# EAGLE design LED Wall Ver 3 (EAGLE 6.3)
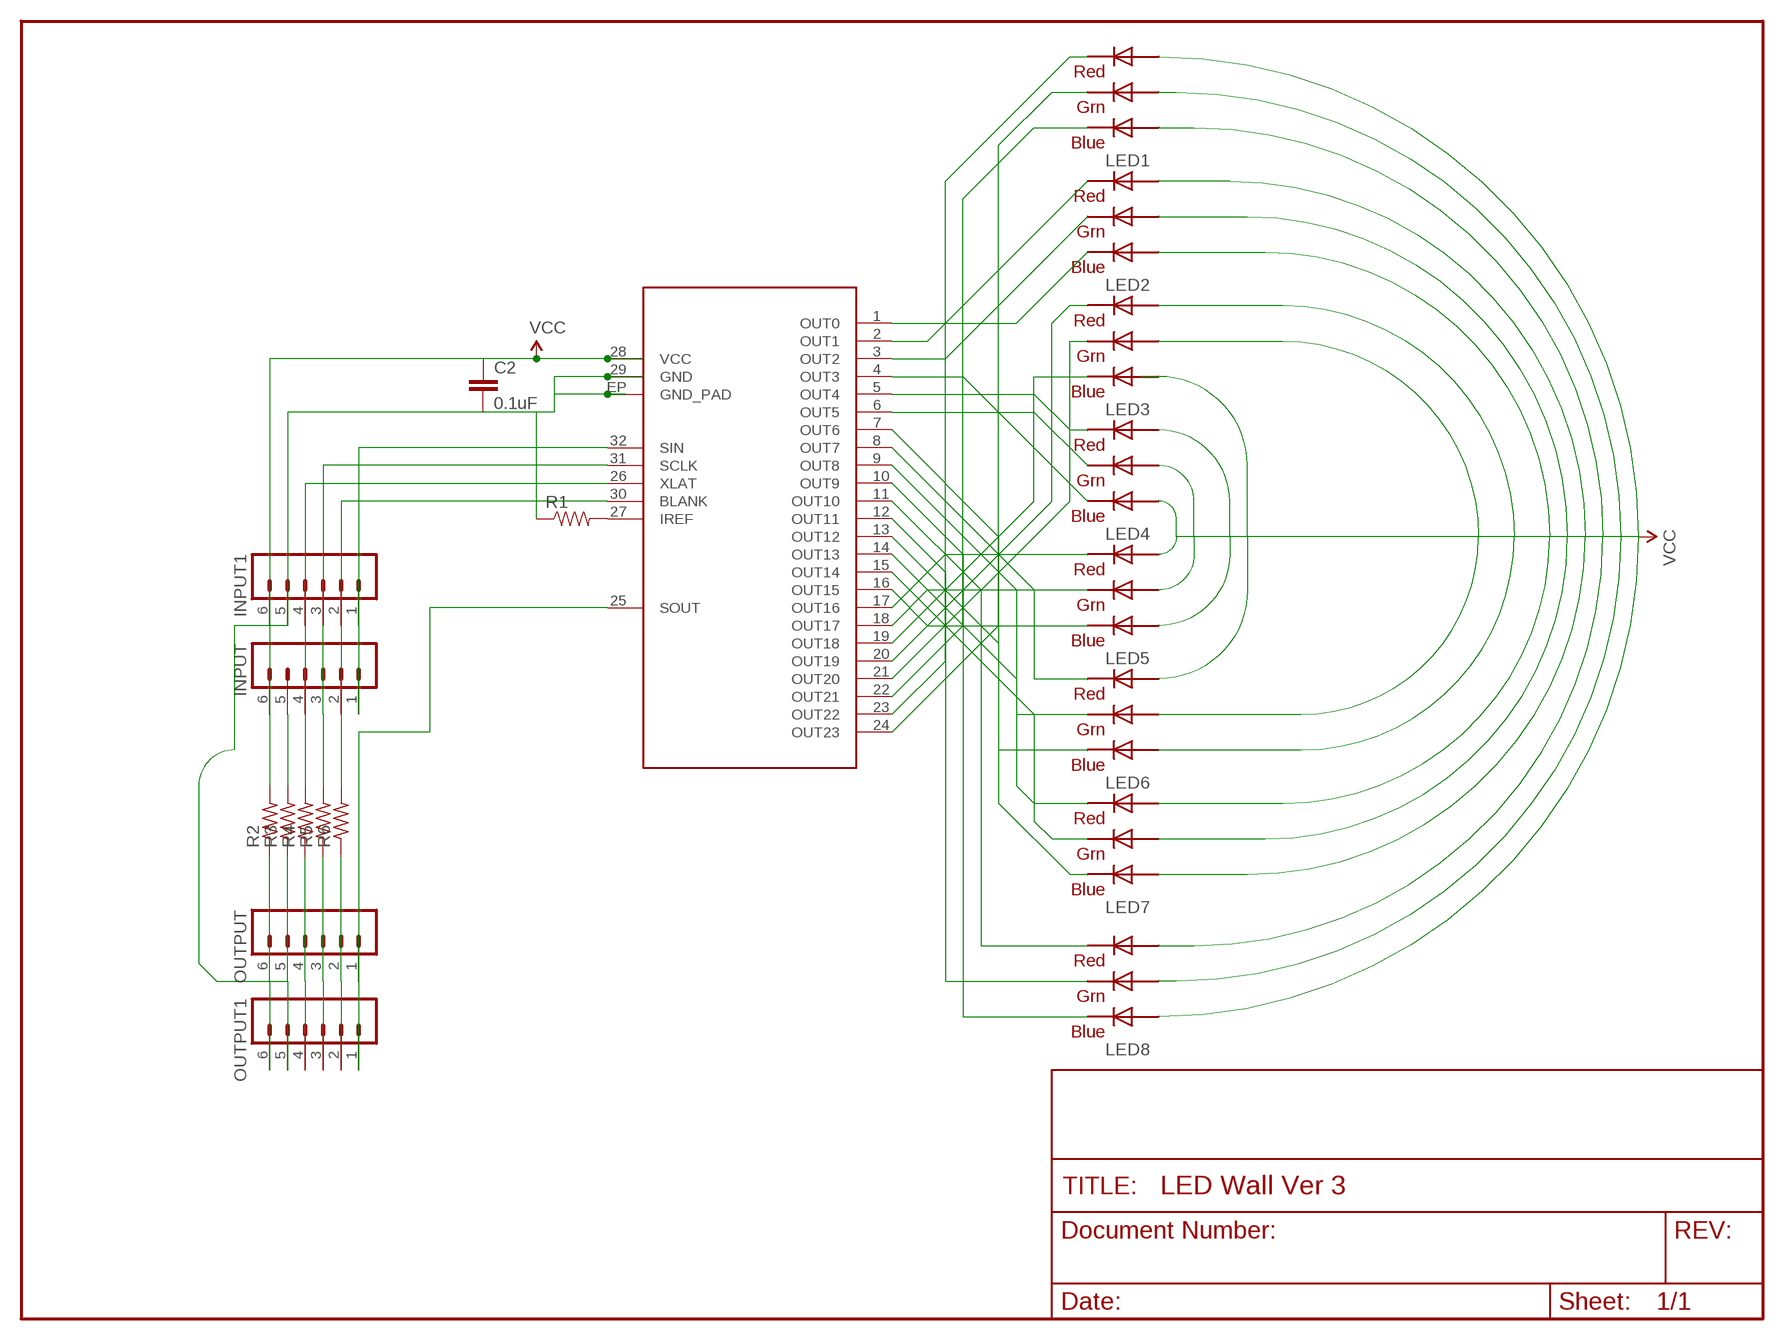
[diagram p0: schematic, sheet 1]

## Parts
C2  0.1uF  CAP0402-CAP  [0402-CAP]
INPUT  M06SMD-FEMALE-V2  [1X06-SMD-FEMALE-V2]
INPUT1  M06SMD-FEMALE-V2  [1X06-SMD-FEMALE-V2]
LED1  RGBLED5050  [RGBLED5050]
LED2  RGBLED5050  [RGBLED5050]
LED3  RGBLED5050  [RGBLED5050]
LED4  RGBLED5050  [RGBLED5050]
LED5  RGBLED5050  [RGBLED5050]
LED6  RGBLED5050  [RGBLED5050]
LED7  RGBLED5050  [RGBLED5050]
LED8  RGBLED5050  [RGBLED5050]
OUTPUT  M06SMD  [1X06-SMD]
OUTPUT1  M06SMD  [1X06-SMD]
R1  RESISTOR0603-RES  [0603-RES]
R2  R-US_R1206W  [R1206W]
R3  R-US_R1206W  [R1206W]
R4  R-US_R1206W  [R1206W]
R5  R-US_R1206W  [R1206W]
R6  R-US_R1206W  [R1206W]
U$2  TLC5947  [QFN-32]

## Nets
BLANK: INPUT1.2 INPUT.2 R6.2 U$2.30(BLANK)
BLANK_2: OUTPUT1.2 OUTPUT.2 R6.1
GND: C2.2 INPUT1.5 OUTPUT1.5 OUTPUT.5 R1.1 R3.1 U$2.29(GND) U$2.EP(GND_PAD)
N$4: LED2.4(BLUE_C) U$2.1(OUT0)
N$5: LED2.5(RED_C) U$2.2(OUT1)
N$7: LED2.6(GREEN_C) U$2.3(OUT2)
N$8: LED8.4(BLUE_C) U$2.10(OUT9)
N$10: LED4.5(RED_C) U$2.5(OUT4)
N$17: LED4.4(BLUE_C) U$2.4(OUT3)
N$18: LED4.6(GREEN_C) U$2.6(OUT5)
N$19: LED6.4(BLUE_C) U$2.7(OUT6)
N$20: LED6.5(RED_C) U$2.8(OUT7)
N$21: LED6.6(GREEN_C) U$2.9(OUT8)
N$22: LED8.5(RED_C) U$2.11(OUT10)
N$23: LED8.6(GREEN_C) U$2.12(OUT11)
N$24: LED7.4(BLUE_C) U$2.13(OUT12)
N$25: LED7.5(RED_C) U$2.14(OUT13)
N$26: LED7.6(GREEN_C) U$2.15(OUT14)
N$27: LED5.4(BLUE_C) U$2.16(OUT15)
N$28: LED5.5(RED_C) U$2.17(OUT16)
N$29: LED5.6(GREEN_C) U$2.18(OUT17)
N$30: LED3.4(BLUE_C) U$2.19(OUT18)
N$31: R1.2 U$2.27(IREF)
N$32: LED3.5(RED_C) U$2.20(OUT19)
N$33: LED3.6(GREEN_C) U$2.21(OUT20)
N$34: LED1.4(BLUE_C) U$2.22(OUT21)
N$35: LED1.5(RED_C) U$2.23(OUT22)
N$36: LED1.6(GREEN_C) U$2.24(OUT23)
N$37: INPUT.5 R3.2
SCLK: INPUT1.3 INPUT.3 R5.2 U$2.31(SCLK)
SCLK_2: OUTPUT1.3 OUTPUT.3 R5.1
SIN: INPUT1.1 INPUT.1 U$2.32(SIN)
SOUT: OUTPUT1.1 OUTPUT.1 U$2.25(SOUT)
VCC: C2.1 INPUT1.6 INPUT.6 LED1.1(GREEN_A) LED1.2(RED_A) LED1.3(BLUE_A) LED2.1(GREEN_A) LED2.2(RED_A) LED2.3(BLUE_A) LED3.1(GREEN_A) LED3.2(RED_A) LED3.3(BLUE_A) LED4.1(GREEN_A) LED4.2(RED_A) LED4.3(BLUE_A) LED5.1(GREEN_A) LED5.2(RED_A) LED5.3(BLUE_A) LED6.1(GREEN_A) LED6.2(RED_A) LED6.3(BLUE_A) LED7.1(GREEN_A) LED7.2(RED_A) LED7.3(BLUE_A) LED8.1(GREEN_A) LED8.2(RED_A) LED8.3(BLUE_A) R2.2 U$2.28(VCC)
VCC_2: OUTPUT1.6 OUTPUT.6 R2.1
XLAT: INPUT1.4 INPUT.4 R4.2 U$2.26(XLAT)
XLAT_2: OUTPUT1.4 OUTPUT.4 R4.1

## Library data of the parts
C2 = SparkFun:CAP: Capacitor Standard 0603 ceramic capacitor, and 0.1" leaded capacitor.
INPUT INPUT1 OUTPUT OUTPUT1 = SparkFun:M06: Header 6 Standard 6-pin 0.1" header. Use with straight break away headers (SKU : PRT-00116), right angle break away headers (PRT-00553), swiss pins (PRT-00743), machine pins (PRT-00117), and female headers (PRT-00115). Molex polarized connector foot print use with SKU : PRT-08094 with associated crimp pins and housings. NOTES ON THE VARIANTS LOCK and LOCK_LONGPADS... This footprint was designed to help hold the alignment of a through-hole component (i.e. 6-pin header) while soldering it into place. You may notice that each hole has been shifted either up or down by 0.005 of an inch from it's more standard position (which is a perfectly straight line). This slight alteration caused the pins (the squares in the middle) to touch the edges of the holes. Because they are alternating, it causes a "brace" to hold the component in place. 0.005 has proven to be the perfect amount of "off-center" position when using our standard breakaway headers. Although looks a little odd when you look at the bare footprint, once you have a header in there, the alteration is very hard to notice. Also, if you push a header all the way into place, it is covered up entirely on the bottom side. This idea of altering the position of holes to aid alignment will be further integrated into the Sparkfun Library for other footprints. It can help hold any component with 3 or more connection pins.
LED1-LED8 = adafruit:RGBLED: For 5050 RGB LEDs, the order of the LEDs may vary from one manufacturer to another!
R1 = SparkFun-Resistors:RESISTOR: Resistor Basic schematic elements and footprints for 0603, 1206, and PTH resistors.
R2-R6 = adafruit:R-US_: RESISTOR, American symbol
U$2 = Shannon:TLC5947

## Board
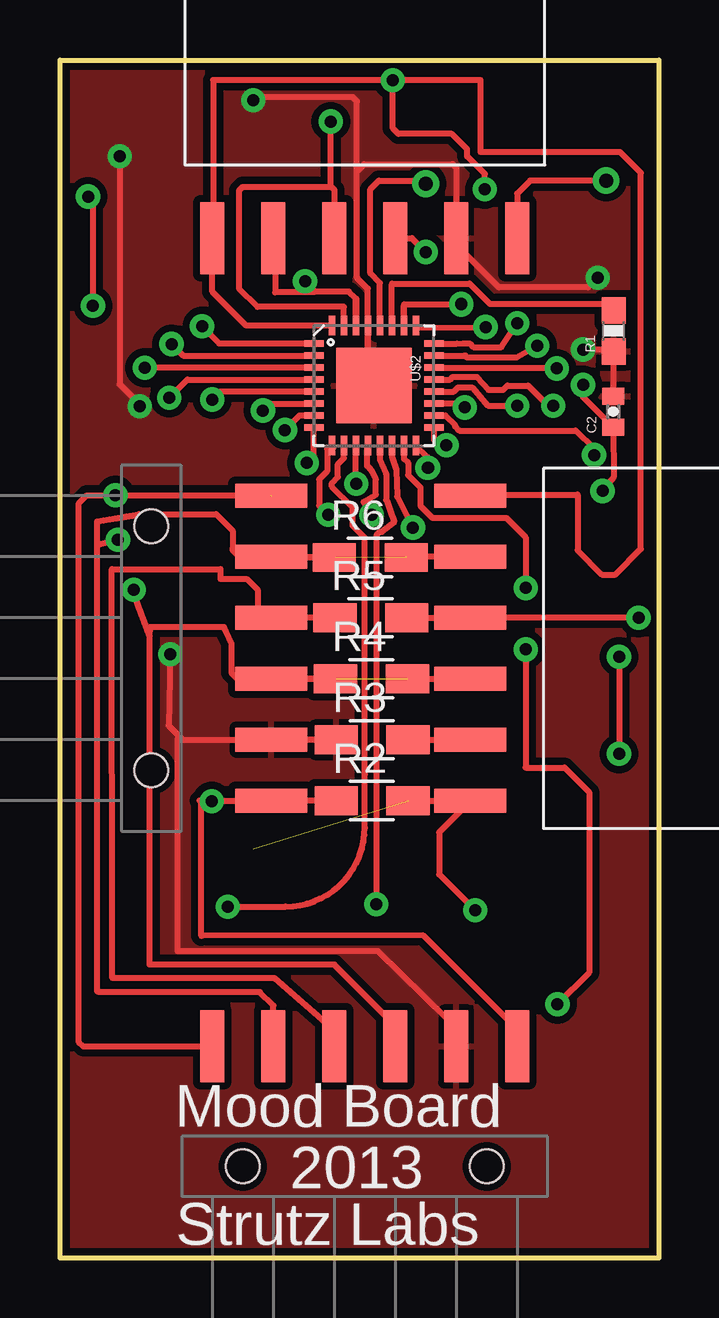
[diagram p1: board, top side]
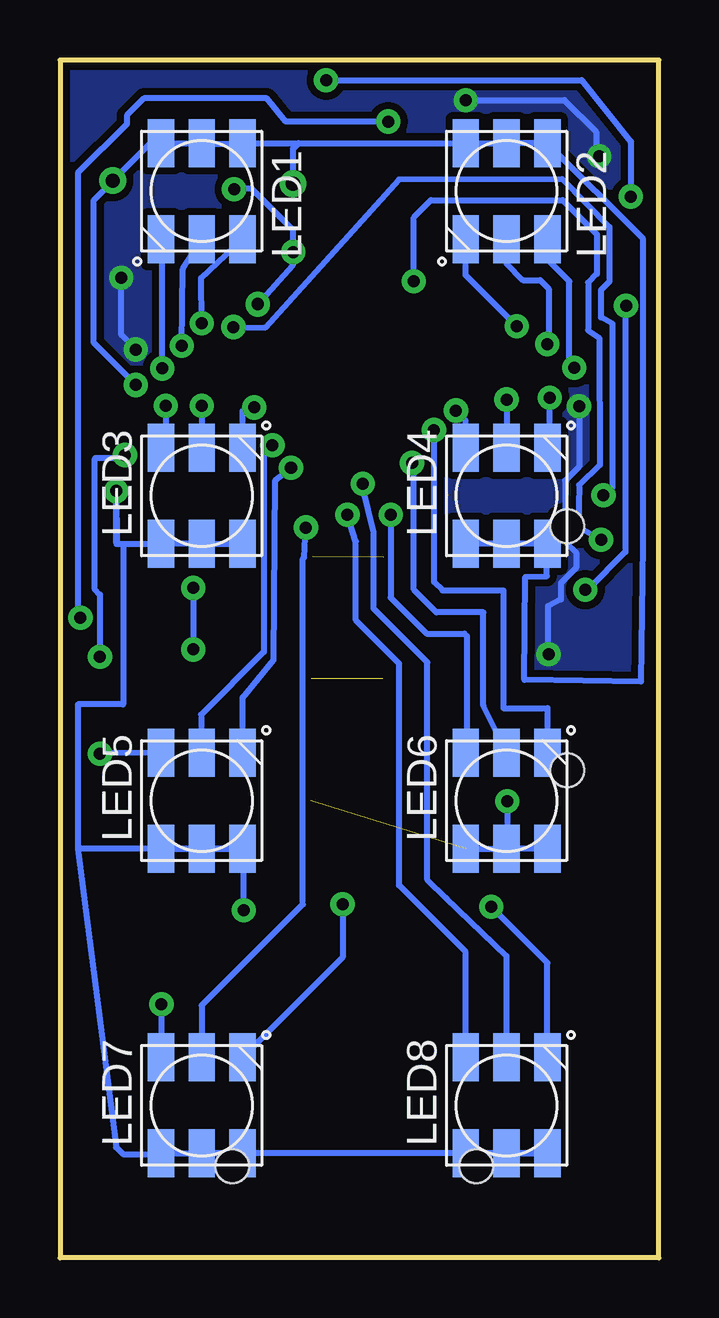
[diagram p2: board, bottom side, seen from below]

Size 24.96 x 49.91 mm. Coordinates in mm from the lower left corner, seen from the top.
Outline: 0,0 24.96,0 24.96,49.91 0,49.91 0,0
Copper layers (1*16): Top 0.035mm / dielectric 1.5mm / Bottom 0.035mm
Design rules "SparkFun": minimum track width 8mil, minimum drill 20mil, track to track 8mil, track to pad 8mil, pad to pad 8mil, via to via 8mil, smd to smd 8mil, copper to edge 8mil, drill to drill 8mil, minimum pad ring 12mil, minimum via ring 10mil, stop-mask expansion 4mil, vias tented up to drill 20mil, thermal gap 10mil

### Footprints (pad centres in the part's own frame; a part is rotated, then mirrored left to right if it is on the bottom)
0402-CAP = smd 0.7 x 0.9: 1 -0.65,0; 2 0.65,0
1X06-SMD-FEMALE-V2 = smd 1 x 3: 1 6.35,4.5; 2 3.81,4.5; 3 1.27,4.5; 4 -1.27,4.5; 5 -3.81,4.5; 6 -6.35,4.5
RGBLED5050 = smd 2 x 1.1: 1 -2,1.7; 2 -2,0; 3 -2,-1.7; 4 2,-1.7; 5 2,0; 6 2,1.7
1X06-SMD = smd 1 x 3: 1 -6.35,5; 2 -3.81,5; 3 -1.27,5; 4 1.27,5; 5 3.81,5; 6 6.35,5 | hole 1.4: -5.08,0; 5.08,0
0603-RES = smd 1.1 x 1: 1 -0.85,0; 2 0.85,0
R1206W = smd 1.8 x 1.2: 1 -1.499,0; 2 1.499,0
QFN-32 = smd 0.285 x 0.8: 1 -1.75,-2.5; 2 -1.25,-2.5; 3 -0.75,-2.5; 4 -0.25,-2.5; 5 0.25,-2.5; 6 0.75,-2.5; 7 1.25,-2.5; 8 1.75,-2.5; 17 1.75,2.5; 18 1.25,2.5; 19 0.75,2.5; 20 0.25,2.5; 21 -0.25,2.5; 22 -0.75,2.5; 23 -1.25,2.5; 24 -1.75,2.5 | smd 0.8 x 0.285: 9 2.5,-1.75; 10 2.5,-1.25; 11 2.5,-0.75; 12 2.5,-0.25; 13 2.5,0.25; 14 2.5,0.75; 15 2.5,1.25; 16 2.5,1.75; 25 -2.5,1.75; 26 -2.5,1.25; 27 -2.5,0.75; 28 -2.5,0.25; 29 -2.5,-0.25; 30 -2.5,-0.75; 31 -2.5,-1.25; 32 -2.5,-1.75 | smd 3.15 x 3.15: EP 0,0

### Placement (x,y rotation side)
C2  23.05,35.26 90 top
INPUT  21.59,25.4 90 top
INPUT1  12.7,46.99 180 top
LED1  19.05,44.45 270 bottom
LED2  6.35,44.45 270 bottom
LED3  19.05,31.75 90 bottom
LED4  6.35,31.75 90 bottom
LED5  19.05,19.05 90 bottom
LED6  6.35,19.05 90 bottom
LED7  19.05,6.35 90 bottom
LED8  6.35,6.35 90 bottom
OUTPUT  3.81,25.4 270 top
OUTPUT1  12.7,3.81 0 top
R1  23.06,38.62 90 top
R2  13,19.05 0 top
R3  13,21.59 0 top
R4  12.98,24.13 0 top
R5  12.95,26.67 0 top
R6  12.93,29.18 0 top
U$2  13.08,36.35 270 top

### Tracks (layer width: path | path; a pad name or v marks a point on that pad's centre or on a via)
BLANK  (via drill 0.5 pad 0.25)  (1 unrouted)
  Top 0.254: INPUT.2 14.43,29.21 R6.2 | INPUT1.2 8.97,42.41 8.97,40.23 8.99,40.26 10.64,40.26 | 12.32,39.98 12.34,39.95 12.34,38.86 U$2.30 12.33,39.94 12.32,39.95 12.32,39.98 | 12.32,39.98 12.04,40.26 10.64,40.26 | 10.64,40.26 v10.21,40.69 | v2.41,29.92 1.55,29.69 1.55,30.68 3.43,30.99 6.5,30.99 7.19,30.3 7.19,29.57 7.47,29.29 9.93,29.29 10.03,29.18 11.48,29.18
  Bottom 0.254: v10.21,40.69 10.21,43.36 9.5,44.07 4.01,44.07 2.59,42.65 2.59,41 2.95,40.64 2.95,38.66 2.49,38.33 2.46,33.05 3.33,32.21 3.35,30.45 v2.41,29.92
BLANK_2
  Top 0.254: R6.1 8.81,29.18 OUTPUT.2 7.47,29.21 7.19,29.49 7.19,30.3 6.5,30.99 3.3,30.99 2.9,30.91 1.57,30.68 1.55,30.66 1.55,11.12 1.6,11.07 8.33,11.07 8.89,10.52 OUTPUT1.2
GND  (via drill 0.5 pad 0.25)
  Top 0.254: 12.83,40.39 12.83,40.38 U$2.29 12.83,36.6 U$2.EP 12.83,36.35 12.83,40.39 | 12.37,45.26 12.37,40.84 12.83,40.39 | 12.37,45.26 12.68,45.57 16.36,45.57 16.51,45.41 INPUT1.5 16.51,42.22 18.29,40.44 22,40.44 v22.4,40.84 | C2.2 23.06,36.65 R1.1 22.99,37.85 v21.79,37.85 | R3.1 OUTPUT.5 5.11,21.59 | OUTPUT1.5 16.51,9.57 16.13,9.96 13.26,12.78 4.9,12.78 4.9,21.61 4.93,21.59 5.11,21.59 | 12.37,45.26 12.37,48.18 12.19,48.36 8.18,48.36 v8.05,48.23 | v2.49,45.9 2.49,36.4 3.33,35.56 v3.33,35.48 | v4.6,25.15 4.52,22.17 5.11,21.59
  Bottom 0.254: v21.79,37.85 22.4,38.46 v22.4,40.84 | v8.05,48.23 3.94,48.23 2.62,46.91 2.62,46.02 v2.49,45.9 | v3.33,35.48 3.33,32.97 3.91,32.38 3.91,31.19 3.81,31.09 3.81,29.74 3.45,29.39 3.45,28.75 4.09,28.12 4.09,27.43 4.62,27.15 4.62,25.3 v4.6,25.15
  pour Bottom (isolate 0.305): 0,49.91 0,0 24.96,0 24.96,49.91
  pour Top (isolate 0.305): 0,49.91 0,0 24.96,0 24.96,49.91
N$4  (via drill 0.5 pad 0.25)
  Top 0.254: U$2.1 6.63,38.1 v5.92,38.81
  Bottom 0.254: v5.92,38.81 8.05,40.94 LED2.4
N$5  (via drill 0.5 pad 0.25)
  Top 0.254: v4.65,38.08 5.12,37.6 U$2.2
  Bottom 0.254: LED2.5 6.35,41.43 5.66,40.74 4.95,40.74 4.6,40.39 4.6,38.12 v4.65,38.08
N$6  (via drill 0.5 pad 0.25)
  other vias: 16.71,39.75
N$7  (via drill 0.5 pad 0.25)
  Top 0.254: U$2.3 3.53,37.1 v3.53,37.08
  Bottom 0.254: v3.53,37.08 3.73,37.29 3.73,40.69 4.65,41.61 LED2.6
N$8  (via drill 0.5 pad 0.25)
  Top 0.254: v6.99,14.63 9.4,14.63 arc90 12.7,17.93 12.7,30 12.19,30.5 12.19,31.27 11.33,32.13 11.33,32.28 11.58,32.54 11.58,33.07 11.83,33.32 U$2.10
  Bottom 0.254: LED8.4 4.65,12.29 v6.99,14.63
N$10  (via drill 0.5 pad 0.25)
  Top 0.254: U$2.5 6.68,36.1 v6.35,35.76
  Bottom 0.254: v6.35,35.76 LED4.5
N$12  (via drill 0.6)
  other vias: 15.24,44.75
N$13  (via drill 0.6)
  other vias: 22.76,44.88
N$16
  Top 0.254: 12.7,17.91 12.7,20.14
N$17  (via drill 0.5 pad 0.25)
  Top 0.254: v4.55,35.84 5.3,36.6 U$2.4
  Bottom 0.254: LED4.4 4.55,33.85 v4.55,35.84
N$18  (via drill 0.5 pad 0.25)
  Top 0.254: v8.46,35.31 8.75,35.6 U$2.6
  Bottom 0.254: LED4.6 8.05,34.9 v8.46,35.31
N$19  (via drill 0.5 pad 0.25)
  Top 0.254: U$2.7 9.98,35.1 v9.37,34.49
  Bottom 0.254: v9.37,34.49 9.37,28.17 9.02,27.81 6.48,27.81 6.48,22.91 4.65,22.91 LED6.4
N$20  (via drill 0.5 pad 0.25)
  Top 0.254: v10.29,33.12 10.58,33.42 U$2.8
  Bottom 0.254: LED6.5 7.32,23.01 7.32,26.9 9.27,26.9 10.21,27.84 10.21,33.05 v10.29,33.12
N$21  (via drill 0.5 pad 0.25)
  Top 0.254: U$2.9 11.4,33.77 11.19,33.77 11.12,33.71 11.12,32.77 10.79,32.44 10.79,31.34 v11.18,30.96
  Bottom 0.254: v11.18,30.96 11.18,27.51 9.68,26.01 8.1,26.01 8,25.91 8,21.1 LED6.6
N$22  (via drill 0.5 pad 0.25)
  Top 0.254: v12.34,32.26 12.33,32.35 U$2.11
  Bottom 0.254: LED8.5 6.35,12.57 8.89,15.01 8.84,14.96 9.65,15.75 9.65,24.82 11.89,27.05 11.89,30.23 12.34,32.11 v12.34,32.26
N$23  (via drill 0.5 pad 0.25)
  Top 0.254: v12.98,30.96 12.65,31.5 13.16,31.8 13.16,32.44 12.98,32.79 12.9,32.89 12.8,32.99 12.8,33.82 U$2.12
  Bottom 0.254: LED8.6 8.05,12.75 10.82,15.52 10.82,24.77 12.62,26.57 12.62,29.84 v12.98,30.96
N$24  (via drill 0.5 pad 0.25)
  Top 0.254: U$2.13 13.33,33.28 13.59,32.66 13.59,31.57 13.61,31.55 13.92,30.66 13.41,30.25 13.31,30.23 13.18,30.1 v13.18,14.73
  Bottom 0.254: v13.18,14.73 13.18,12.52 LED7.4
N$25  (via drill 0.5 pad 0.25)
  Top 0.254: U$2.14 13.83,33.39 14.02,32.84 14.05,31.73 v14.71,30.43
  Bottom 0.254: LED7.5 19.05,10.52 14.83,14.73 14.83,29.13 14.78,29.18 v14.71,30.43
N$26  (via drill 0.5 pad 0.25)
  Top 0.254: U$2.15 14.33,33.29 14.5,33.12 14.5,32.61 15.01,32.11 15.01,31.34 15.52,30.84 18.59,30.84 19.41,30.02 v19.41,27.91 | v19.41,25.35 19.41,20.42 21.03,20.42 22.05,19.41 22.05,11.89 v20.73,10.57
  Bottom 0.254: v19.41,27.91 v19.41,25.35 | v20.73,10.57 20.73,8.37 LED7.6
N$27  (via drill 0.5 pad 0.25)
  Top 0.254: v15.32,32.92 15.32,33.36 U$2.16
  Bottom 0.254: LED5.4 17.35,23.34 16.05,24.92 15.98,32.41 v15.32,32.92
N$28  (via drill 0.5 pad 0.25)
  Top 0.254: U$2.17 15.58,34.08 v16.1,33.86
  Bottom 0.254: v16.1,33.86 16.46,33.63 16.46,25.25 19.07,22.63 19.07,21.07 LED5.5
N$29  (via drill 0.5 pad 0.25)
  Top 0.254: U$2.18 16.06,35.1 16.46,34.7 16.46,34.65 16.64,34.47 21.49,34.47 22.25,33.71 v22.25,33.45 | v23.29,25.04 v23.29,21.01
  Bottom 0.254: v22.25,33.45 22.38,33.33 23.47,33.33 23.52,33.27 23.52,27.89 23.29,27.64 v23.29,25.04 | v23.29,21.01 23.29,21.06 LED5.6
N$30  (via drill 0.5 pad 0.25)
  Top 0.254: v16.87,35.43 16.9,35.6 U$2.19
  Bottom 0.254: LED3.4 17.35,35.28 17.09,35.53 v16.87,35.43
N$31
  Top 0.254: U$2.27 13.83,40.58 13.84,40.59 17.07,40.59 17.91,39.75 23.19,39.75 23.21,39.47 R1.2
N$32  (via drill 0.5 pad 0.25)
  Top 0.254: U$2.20 16.41,36.1 16.59,36.27 17.17,36.27 17.83,35.51 v19.05,35.51
  Bottom 0.254: v19.05,35.51 LED3.5
N$33  (via drill 0.5 pad 0.25)
  Top 0.254: U$2.21 16.25,36.6 16.36,36.7 17.37,36.7 17.86,36.17 18.47,36.17 18.64,36.35 19.51,36.35 20.34,35.51 v20.55,35.51
  Bottom 0.254: v20.55,35.51 20.55,33.95 LED3.6
N$34  (via drill 0.5 pad 0.25)
  Top 0.254: U$2.22 20.66,37.1 v20.7,37.06
  Bottom 0.254: v20.7,37.06 20.7,42.4 LED1.4
N$35  (via drill 0.5 pad 0.25)
  Top 0.254: U$2.23 16.86,37.6 16.87,37.59 16.89,37.59 16.97,37.52 19.02,37.52 v19.89,38
  Bottom 0.254: v19.89,38 19.84,41.2 LED1.5
N$36  (via drill 0.5 pad 0.25)
  Top 0.254: U$2.24 16.53,38.1 16.79,38.1 17.07,38.1 17.22,37.95 18.39,37.95 v19.05,38.94
  Bottom 0.254: v19.05,38.94 19.07,40.83 LED1.6
N$37
  Top 0.254: R3.2 INPUT.5
N$40  (via drill 0.5 pad 0.25)
  other vias: 15.34,32.92
SCLK  (via drill 0.5 pad 0.25)
  Top 0.254: 11.28,44.63 11.3,44.63 11.43,44.5 INPUT1.3 | U$2.31 11.83,39.62 11.84,39.62 8.23,39.62 7.47,40.39 7.47,44.48 7.62,44.63 11.28,44.63 | 11.28,44.63 v11.28,47.35 | v24.11,26.67 INPUT.3 R5.2
  Bottom 0.254: v11.28,47.35 15.54,47.35 16.33,48.31 21.46,48.31 22.17,47.6 22.17,47.24 24.21,45.21 24.21,26.77 v24.11,26.67
SCLK_2
  Top 0.254: R5.1 OUTPUT.3 | OUTPUT1.3 11.43,9.47 8.94,11.66 2.18,11.66 2.16,28.7 6.68,28.7 6.68,28.3 7.77,28.3 8.23,27.84 8.23,26.7 8.26,26.67 OUTPUT.3 | 8.79,26.7 OUTPUT.3
SIN
  Top 0.254: U$2.32 7.76,38.85 6.35,40.26 INPUT1.1 6.38,42.52 6.38,49.07 17.53,49.07 17.53,46.08 23.34,46.08 24.21,45.21 24.21,29.54 23.14,28.47 22.58,28.47 21.57,29.49 21.57,31.8 17.14,31.8 INPUT.1
SOUT  (via drill 0.5 pad 0.25)  (1 unrouted)
  Top 0.254: U$2.25 14.92,38.76 v17.73,38.79 | 8.79,31.77 v2.31,31.77 1.12,31.77 0.79,31.45 0.79,8.99 0.97,8.81 OUTPUT1.1
  Bottom 0.254: v17.73,38.79 16.41,38.76 10.82,44.93 4.04,44.96 2.06,42.95 2.06,40.69 2.41,40.34 2.41,39.19 1.93,38.91 1.93,32.11 2.06,32.03 v2.31,31.77
VCC  (via drill 0.5 pad 0.25, 0.6)  (1 unrouted)
  Top 0.254: U$2.28 13.33,40.62 12.93,41.02 12.93,44.53 13.28,44.88 15.11,44.88 v15.24,44.76 | v22.76,44.88 19.58,44.88 19.05,44.35 INPUT1.6 | v21.79,36.37 21.79,35.86 C2.1 23.06,32.53 v22.61,31.95 | 6.35,19.05 v6.33,19.02 | R2.2 INPUT.6 17.09,19.02 15.8,17.73 15.8,15.98 v17.3,14.48
  Bottom 0.254: LED8.1 LED8.2 LED8.3 LED7.2 | LED7.1 20.24,4.35 | 20.24,4.35 LED7.2 | LED7.2 LED7.3 | LED6.1 LED6.2 | LED6.3 LED6.2 | LED5.3 LED5.1 | LED5.1 LED5.2 LED5.3 | LED1.3 LED1.2 19,46.45 19,46.43 | 19,46.43 17.35,46.43 LED1.1 15.01,46.45 | 15.01,46.45 LED2.3 LED2.2 | LED2.2 6.27,46.45 6.27,46.46 | 6.27,46.46 LED2.1 0.66,42.46 0.66,29.74 0.74,24.01 5.61,24.09 5.56,28.37 4.67,28.4 LED4.3 LED4.2 LED4.1 | v15.24,44.76 15.24,46.22 15.01,46.45 | 19,46.43 21.21,46.43 v22.76,44.88 22.76,44.86 23.55,44.07 23.55,38.12 v21.79,36.37 | v6.33,19.02 6.33,17.07 LED6.2 | 24.21,17.17 24.21,23.06 22.33,23.06 22.33,29.74 22.61,29.77 v22.61,31.95 22.6,29.75 LED3.1 LED3.2 LED3.3 | 24.21,17.17 24.21,17.04 24.21,17.05 22.61,4.6 22.33,4.32 20.28,4.32 20.24,4.35 | 6.27,46.46 LED2.2 | LED5.1 24.09,17.05 24.21,17.17 | v17.3,14.48 17.3,17 LED5.3
VCC_2
  Top 0.254: R2.1 OUTPUT.6 5.89,19.05 | 5.89,19.05 5.89,13.41 15.13,13.44 19.05,9.52 OUTPUT1.6 | 5.89,19.05 5.82,19.05
XLAT  (via drill 0.5 pad 0.25)  (1 unrouted)
  Top 0.254: INPUT1.4 14.66,42.49 v15.24,41.91 | 14.35,39.73 14.33,39.73 U$2.26 14.33,39.68 14.35,39.7 14.35,39.73 | R4.2 INPUT.4 | 14.35,39.73 v16.71,39.73 | v17.7,44.53 17.7,45.16 16.97,45.9 16.97,46.2 16.33,46.84 14.1,46.84 13.87,47.07 v13.87,49.07 | v1.17,44.22 1.37,44.02 v1.37,39.67 | v3.07,27.84 3.1,27.56 3.73,25.86 3.76,26.29 6.81,26.29 7.14,25.6 7.14,24.38 7.39,24.13 11.51,24.13
  Bottom 0.254: v15.24,41.91 15.27,41.35 | v16.71,39.73 15.27,41.35 | 15.27,41.35 15.24,41.88 15.24,42.82 16.97,44.55 17.68,44.55 v17.7,44.53 | v13.87,49.07 3.23,49.07 1.17,46.51 v1.17,44.22 | v1.37,39.67 1.4,39.65 1.4,29.41 2.95,27.86 v3.07,27.84
XLAT_2
  Top 0.254: R4.1 OUTPUT.4 7.39,24.13 7.14,24.38 7.14,25.6 6.83,26.29 3.76,26.29 3.73,25.88 3.73,12.22 11.43,12.22 13.97,9.68 OUTPUT1.4

### Text on the board
_tsilk: Mood Board | 2013 | Strutz Labs